# EAGLE design transducer (EAGLE 8.5.1)
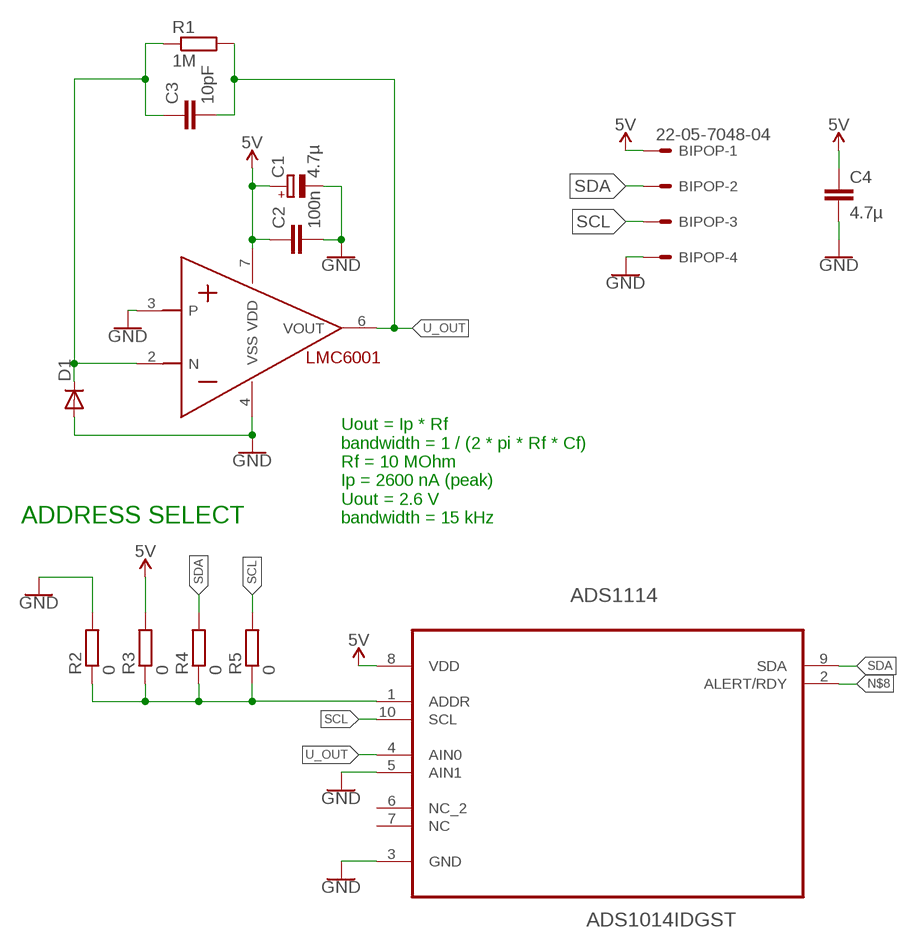
[diagram p0: schematic, sheet 1]

## Parts
ADS1114  ADS1014IDGST  [SOP50P490X110-10N]
BIPOP  22-05-7048-04  [7395-04]
C1  4.7µ  CPOL-EUA/3216-18R  [A/3216-18R]
C2  100n  C-EUC0805  [C0805]
C3  10pF  C-EUC0603  [C0603]
C4  4.7µ  C-EUC0805  [C0805]
D1  DIODE-TO18D  [TO18D]
LMC6001  LMC6001  [DIL08]
R1  1M  R-EU_R0805  [R0805]
R2  0  R-EU_R0805  [R0805]
R3  0  R-EU_R0805  [R0805]
R4  0  R-EU_R0805  [R0805]
R5  0  R-EU_R0805  [R0805]

## Nets
5V: ADS1114.8(VDD) BIPOP.1 C1.+ C2.1 C4.1 LMC6001.7(VDD) R3.2
ADR: ADS1114.1(ADDR) R2.1 R3.1 R4.1 R5.1
CATH: C3.1 D1.C LMC6001.2(N) R1.1
GND: ADS1114.3(GND) ADS1114.5(AIN1) BIPOP.4 C1.- C2.2 C4.2 D1.A LMC6001.3(P) LMC6001.4(VSS) R2.2
N$8: ADS1114.2(ALERT/RDY)
SCL: ADS1114.10(SCL) BIPOP.3 R5.2
SDA: ADS1114.9(SDA) BIPOP.2 R4.2
U_OUT: ADS1114.4(AIN0) C3.2 LMC6001.6(VOUT) R1.2
Unconnected: ADS1114.6(NC_2) ADS1114.7(NC)

## Notes on the sheet
- ADDRESS SELECT
- Uout = Ip * Rf
  bandwidth = 1 / (2 * pi * Rf * Cf)
  Rf = 10 MOhm
  Ip = 2600 nA (peak)
  Uout = 2.6 V
  bandwidth = 15 kHz

## Library data of the parts
ADS1114 = Texas Instruments_By_element14_Batch_1:ADS1014IDGST: Ultra-Small, Low-Power, 12-Bit Analog-to-Digital Converter with Internal Reference; MPN: ADS1014IDGST; OC_FARNELL: 1778210; OC_NEWARK: 35R0210; PACKAGE: MSOP-10; SUPPLIER: Texas Instruments
BIPOP = EP_molex_6410_7395:22-?-04: CONNECTOR wire to board 2.54 mm (.1 inch) pitch header
C1 = rcl:CPOL-EU: POLARIZED CAPACITOR, European symbol; SPICEPREFIX: C
C2 = resistor:C-EU: CAPACITOR, European symbol
C3 C4 = rcl:C-EU: CAPACITOR, European symbol; SPICEPREFIX: C
D1 = diode:DIODE-: DIODE
LMC6001 = customy:LMC6001: Operational amplifier for photometric applications.
R1-R5 = rcl:R-EU_: RESISTOR, European symbol; SPICEPREFIX: R

## Board
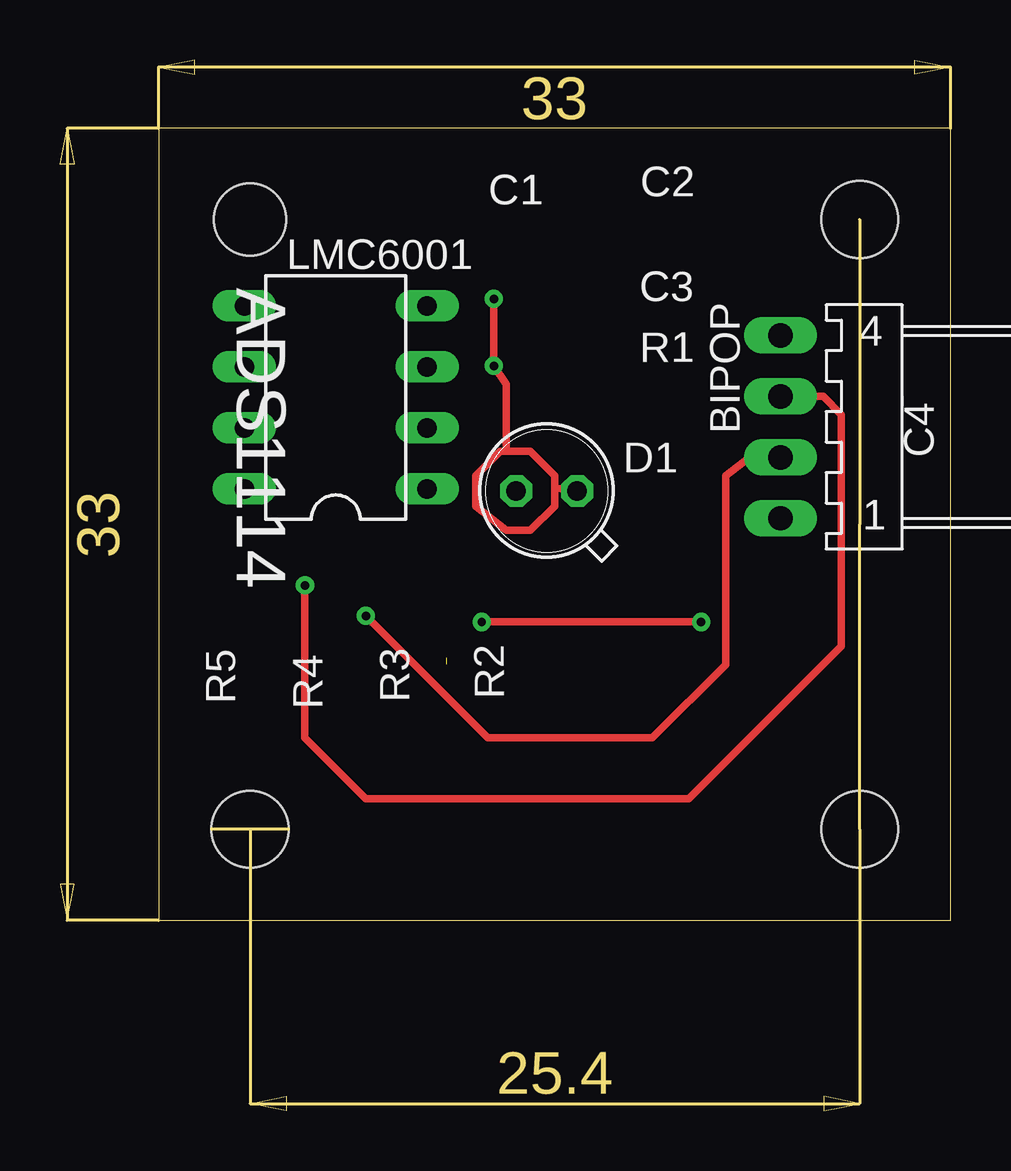
[diagram p1: board, top side]
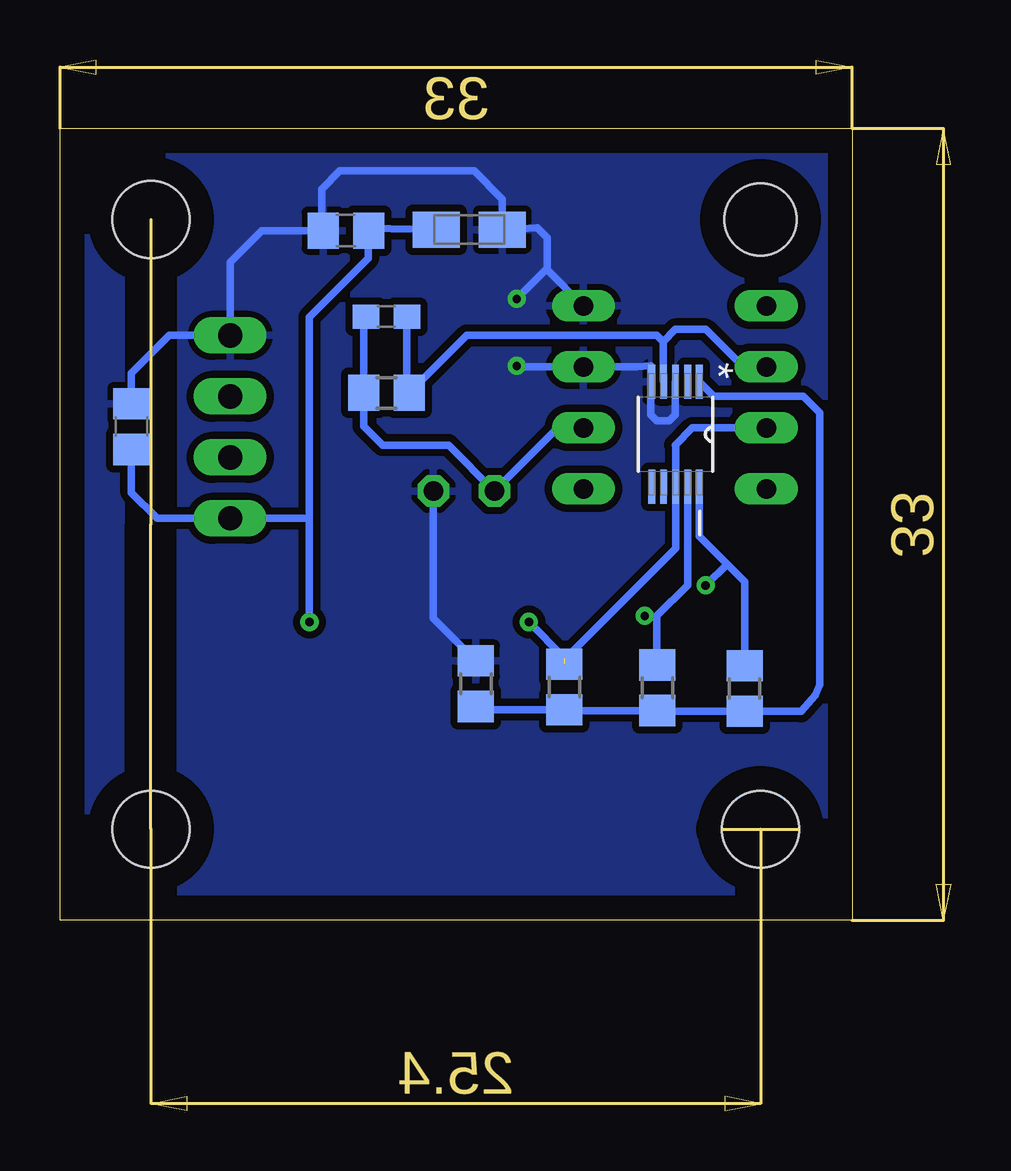
[diagram p2: board, bottom side, seen from below]

Size 33 x 33 mm. Coordinates in mm from the lower left corner, seen from the top.
Outline: 0,0 33,0 33,33 0,33 0,0
Copper layers (1*16): Top 0.035mm / dielectric 1.5mm / Bottom 0.035mm
Design rules "default": minimum track width 6mil, minimum drill 0.35mm, track to track 6mil, track to pad 6mil, pad to pad 6mil, via to via 6mil, smd to smd 6mil, copper to edge 40mil, drill to drill 6mil, minimum pad ring 10mil, minimum via ring 8mil, stop-mask expansion 4mil, vias tented up to drill 0mil, thermal gap 10mil
Holes 3.2 mm at 3.81,3.8 29.21,3.8 29.21,29.2
Holes 3 mm at 3.81,29.2

### Footprints (pad centres in the part's own frame; a part is rotated, then mirrored left to right if it is on the bottom)
SOP50P490X110-10N = smd 1.422 x 0.279: 1 -2.184,0.991; 2 -2.184,0.508; 3 -2.184,0; 4 -2.184,-0.508; 5 -2.184,-0.991; 6 2.184,-0.991; 7 2.184,-0.508; 8 2.184,0; 9 2.184,0.508; 10 2.184,0.991
7395-04 = drill 1.016 long: 1 3.81,0; 2 1.27,0; 3 -1.27,0; 4 -3.81,0
A/3216-18R = smd 1.95 x 1.5: + 1.375,0; - -1.375,0
C0805 = smd 1.3 x 1.5: 1 -0.95,0; 2 0.95,0
C0603 = smd 1.1 x 1: 1 -0.85,0; 2 0.85,0
TO18D = drill 0.813 octagon: A 1.27,0; C -1.27,0
DIL08 = drill 0.813 long: 1 -3.81,-3.81; 2 -1.27,-3.81; 3 1.27,-3.81; 4 3.81,-3.81; 5 3.81,3.81; 6 1.27,3.81; 7 -1.27,3.81; 8 -3.81,3.81
R0805 = smd 1.3 x 1.5: 1 -0.95,0; 2 0.95,0

### Placement (x,y rotation side)
ADS1114  7.35,20.25 270 bottom
BIPOP  25.91,20.56 270 top
C1  15.95,28.79 180 bottom
C2  21.09,28.74 180 bottom
C3  19.4,25.15 0 bottom
C4  30.02,20.57 90 bottom
D1  16.17,17.89 0 top
LMC6001  7.38,21.79 90 top
R1  19.4,21.98 0 bottom
R2  15.67,9.86 90 bottom
R3  11.98,9.73 90 bottom
R4  8.11,9.69 90 bottom
R5  4.47,9.66 90 bottom

### Tracks (layer width: path | path; a pad name or v marks a point on that pad's centre or on a via)
5V  (via drill 0.35)  (2 unrouted)
  Top 0.305: v22.61,12.44 v13.46,12.44
  Bottom 0.152: 20.16,28.83 C2.1 | 7.37,19.8 7.35,19.79
  Bottom 0.305: C4.1 30.02,17.82 28.96,16.75 28.7,16.75 BIPOP.1 22.61,16.75 | C1.+ 20.16,28.83 20.16,27.58 22.61,25.14 22.61,16.75 | 22.61,16.75 v22.61,12.44 | v13.46,12.44 11.98,10.95 | 7.37,19.8 6.65,20.52 LMC6001.7 | 7.35,19.79 ADS1114.8 7.35,15.5 11.98,10.87
ADR
  Bottom 0.152: 8.08,8.71 R4.1 | 11.95,8.74 R3.1 | 15.53,8.78 R2.1
  Bottom 0.305: ADS1114.1 5.76,21.83 2.03,21.83 1.35,21.15 1.35,9.82 1.52,9.39 2.12,8.71 R5.1 8.08,8.71 | R4.1 11.95,8.74 | R3.1 15.53,8.78
CATH
  Bottom 0.152: 20.35,25.05 C3.1
  Bottom 0.305: LMC6001.2 12.27,20.52 D1.C 16.81,19.8 19.56,19.8 20.35,20.59 R1.1 20.35,25.05
GND  (via drill 0.35)
  Top 0.305: v13.97,25.9 v13.97,23.1 14.48,22.34 14.48,19.55 | 14.48,19.55 15.49,19.55 16.51,18.53 16.51,18.02 | 16.51,18.02 16.51,17.26 15.49,16.25 14.48,16.25 13.21,17.26 13.21,18.53 14.22,19.55 14.48,19.55 | 16.51,18.02 17.41,17.89 D1.A
  Bottom 0.152: LMC6001.3 11.18,23.06 11.19,23.07 | ADS1114.3 7.37,22.42 | 8.38,22.4 ADS1114.5 | C4.2 30.03,21.27 29.97,21.33 29.97,21.23 | 22.1,28.8 C2.2 | 13.67,23.06 13.72,23.1 v13.97,23.1 | 12.76,27.11 12.7,27.11
  Bottom 0.305: ADS1114.5 8.38,22.48 8.38,23.1 8.96,23.06 11.18,23.06 | 7.37,22.42 7.37,21.07 7.62,20.82 8.13,20.82 8.38,21.07 8.38,22.4 | D1.A 17.44,12.58 R2.2 | LMC6001.4 12.7,27.11 12.7,28.44 13.12,28.85 C1.- 14.57,30.06 15.75,31.23 21.34,31.23 22.1,30.47 22.1,28.8 | C4.2 30.02,22.8 28.45,24.37 BIPOP.4 25.91,27.42 24.59,28.74 C2.2 | LMC6001.3 13.67,23.06 | v13.97,25.9 12.76,27.11
  pour Bottom (isolate 0.305): 0.25,32.76 32.77,32.76 32.77,0.24 0.25,0.24
SCL  (via drill 0.35)
  Top 0.305: BIPOP.3 27.69,21.83 28.45,21.07 28.45,11.42 22.1,5.07 8.64,5.07 6.1,7.61 v6.1,13.96
  Bottom 0.305: R5.2 4.47,14.11 5.21,14.85 | 5.21,14.85 6.36,16 ADS1114.10 | v6.1,13.96 5.21,14.85
SDA  (via drill 0.35)
  Top 0.305: v8.64,12.69 13.72,7.61 20.57,7.61 23.62,10.66 23.62,18.53 24.64,19.29 BIPOP.2
  Bottom 0.152: 8.13,10.66 R4.2 | 8.13,12.69 v8.64,12.69
  Bottom 0.305: 8.13,10.66 8.13,12.69 6.84,13.97 ADS1114.9
U_OUT
  Bottom 0.152: 7.87,24.12 7.86,24.11 | 18.55,22.08 R1.2
  Bottom 0.305: LMC6001.6 4.53,23.06 6.1,24.63 7.37,24.63 7.87,24.12 8.13,24.37 16.06,24.37 R1.2 | 7.86,24.11 ADS1114.4 | C3.2 18.55,22.08